# EAGLE design arduino_usb_08 (EAGLE 4.13)
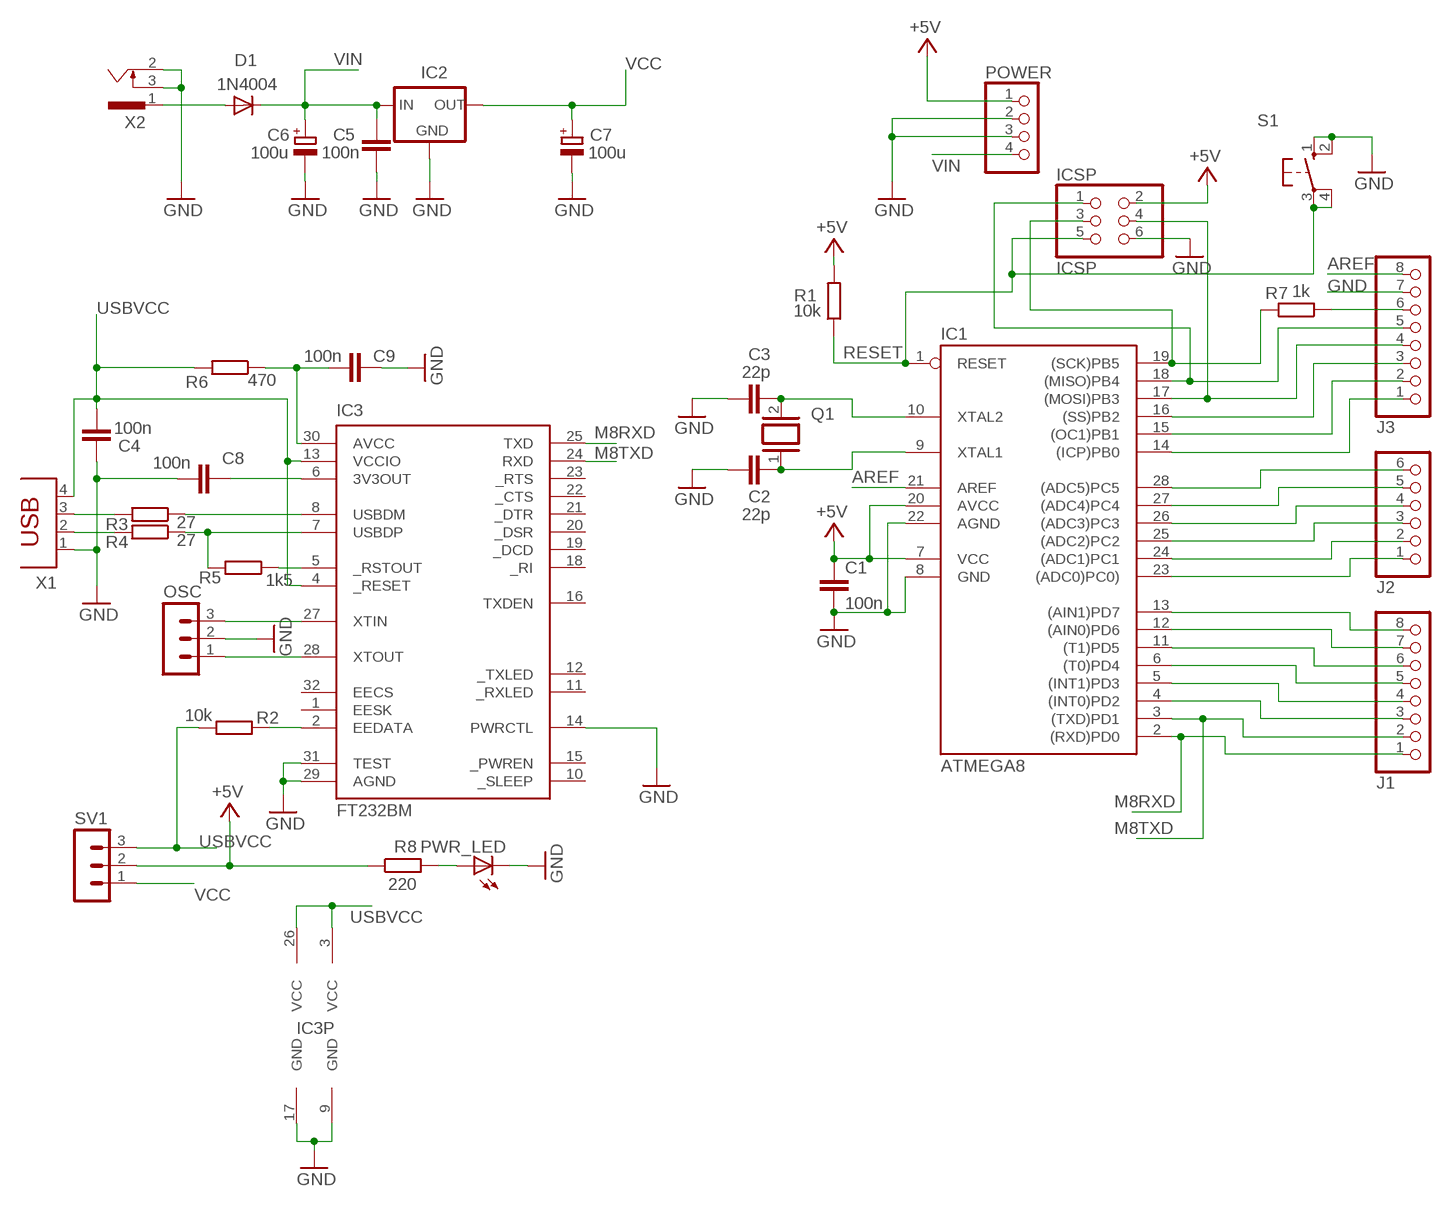
[diagram p0: schematic, sheet 1]

## Parts
C1  100n  C-EU050-025X075  [C050-025X075]
C2  22p  C-EU050-025X075  [C050-025X075]
C3  22p  C-EU050-025X075  [C050-025X075]
C4  100n  C-EU050-025X075  [C050-025X075]
C5  100n  C-EU050-025X075  [C050-025X075]
C6  100u  CPOL-EUE3.5-8  [E3,5-8]
C7  100u  CPOL-EUE3.5-8  [E3,5-8]
C8  100n  C-EU050-025X075  [C050-025X075]
C9  100n  C-EU050-025X075  [C050-025X075]
D1  1N4004  [DO41-10]
IC1  ATMEGA8  AT90S4433P  [DIL28-3]
IC2  78XXL  [78XXL]
IC3  FT232BM  [LQFP-32]
ICSP  ICSP  PINHD-2X3  [2X03]
J1  PINHD-1X8  [1X08]
J2  PINHD-1X6  [1X06]
J3  PINHD-1X8  [1X08]
OSC  MA03-1  [MA03-1]
POWER  PINHD-1X4  [1X04]
PWR_LED  LED3MM  [LED3MM]
Q1  XTAL/S  [QS]
R1  10k  R-EU_0207/10  [0207/10]
R2  10k  R-EU_0207/10  [0207/10]
R3  27  R-EU_0207/10  [0207/10]
R4  27  R-EU_0207/10  [0207/10]
R5  1k5  R-EU_0207/10  [0207/10]
R6  470  R-EU_0207/10  [0207/10]
R7  1k  R-EU_0207/10  [0207/10]
R8  220  R-EU_0207/10  [0207/10]
S1  10-XX  [B3F-10XX]
SV1  MA03-1  [MA03-1]
X1  PN61729  [PN61729]
X2  SCD-014A  [SCD-014-A]

## Nets
+5V [power]: C1.1 IC1.7(VCC) IC1.20(AVCC) ICSP.2 POWER.1 R1.2 R8.1 SV1.2
AREF: IC1.21(AREF) J3.8
GND [power]: C1.2 C2.1 C3.1 C4.2 C5.1 C6.- C7.- C8.1 C9.2 IC1.8(GND) IC1.22(AGND) IC2.GND IC3.9(GND) IC3.14(PWRCTL) IC3.17(GND) IC3.29(AGND) IC3.31(TEST) ICSP.6 J3.7 OSC.2 POWER.2 POWER.3 PWR_LED.K(C) S1.1(S) S1.2(S1) X1.1 X2.2 X2.3
M8RXD: IC1.2((RXD)PD0) IC3.25(TXD) J1.1
M8TXD: IC1.3((TXD)PD1) IC3.24(RXD) J1.2
N$1: IC1.18((MISO)PB4) ICSP.1 J3.5
N$2: J3.6 R7.1
N$3: PWR_LED.A R8.2
N$4: IC1.17((MOSI)PB3) ICSP.4 J3.4
N$5: IC1.14((ICP)PB0) J3.1
N$6: C2.2 IC1.9(XTAL1) Q1.1
N$7: C3.2 IC1.10(XTAL2) Q1.2
N$8 [power]: D1.A X2.1
N$9: R3.2 X1.3
N$10: IC1.4((INT0)PD2) J1.3
N$11: IC1.5((INT1)PD3) J1.4
N$12: IC1.6((T0)PD4) J1.5
N$13: IC1.11((T1)PD5) J1.6
N$14: IC1.12((AIN0)PD6) J1.7
N$15: IC1.13((AIN1)PD7) J1.8
N$16: IC1.23((ADC0)PC0)) J2.1
N$17: IC1.24((ADC1)PC1) J2.2
N$18: IC1.25((ADC2)PC2) J2.3
N$19: IC1.26((ADC3)PC3) J2.4
N$20: IC1.27((ADC4)PC4) J2.5
N$21: IC1.28((ADC5)PC5) J2.6
N$22: IC1.15((OC1)PB1) J3.2
N$23: IC1.16((SS)PB2) J3.3
N$24: R4.2 X1.2
N$25: IC3.8(USBDM) R3.1
N$26: IC3.7(USBDP) R4.1 R5.2
N$27: IC3.5(_RSTOUT) R5.1
N$28: C8.2 IC3.6(3V3OUT)
N$29: IC3.27(XTIN) OSC.3
N$30: C9.1 IC3.30(AVCC) R6.1
N$31: IC3.28(XTOUT) OSC.1
N$33: IC3.2(EEDATA) R2.2
RESET: IC1.1(RESET) ICSP.5 R1.1 S1.3(P) S1.4(P1)
SCK: IC1.19((SCK)PB5) ICSP.3 R7.2
USBVCC: C4.1 IC3.3(VCC) IC3.4(_RESET) IC3.13(VCCIO) IC3.26(VCC) R2.1 R6.2 SV1.3 X1.4
VCC: C7.+ IC2.OUT SV1.1
VIN [power]: C5.2 C6.+ D1.C IC2.IN POWER.4
Unconnected: IC3.1(EESK) IC3.10(_SLEEP) IC3.11(_RXLED) IC3.12(_TXLED) IC3.15(_PWREN) IC3.16(TXDEN) IC3.18(_RI) IC3.19(_DCD) IC3.20(_DSR) IC3.21(_DTR) IC3.22(_CTS) IC3.23(_RTS) IC3.32(EECS)

## Library data of the parts
C1-C5 C8 C9 = rcl:C-EU: CAPACITOR, European symbol
C6 C7 = rcl:CPOL-EU: POLARIZED CAPACITOR, European symbol
D1 = diode:1N4004: DIODE general purpose rectifier, 1 A
IC1 = atmel:AT90S4433: MICROCONTROLLER 4 Kbytes FLASH 128 bytes SRAM 256 bytes EEPROM UART 6-channel 10 bit ADC
IC2 = v-reg:78XXL: VOLTAGE REGULATOR
IC3 = ftdi:FT232BM: USB UART 2nd Generation USB UART (USB <-> Serial)
ICSP = pinhead:PINHD-2X3: PIN HEADER
J1 J3 = pinhead:PINHD-1X8: PIN HEADER
J2 = pinhead:PINHD-1X6: PIN HEADER
OSC SV1 = con-lstb:MA03-1: PIN HEADER
POWER = pinhead:PINHD-1X4: PIN HEADER
PWR_LED = led:LED: LED OSRAM: - CHIPLED LG R971, LG N971, LY N971, LG Q971, LY Q971, LO R971, LY R971 LH N974, LH R974 LS Q976, LO Q976, LY Q976 LO Q996 - Hyper CHIPLED LW Q18S LB Q993, LB Q99A, LB R99A - SideLED LS A670, LO A670, LY A670, LG A670, LP A670 LB A673, LV A673, LT A673, LW A673 LH A674 LY A675 LS A676, LA A676, LO A676, LY A676, LW A676 LS A679, LY A679, LG A679 - Hyper Micro SIDELED® LS Y876, LA Y876, LO Y876, LY Y876 LT Y87S - SmartLED LW L88C, LW L88S LB L89C, LB L89S, LG L890 LS L89K, LO L89K, LY L89K LS L896, LA L896, LO L896, LY L896 - TOPLED LS T670, LO T670, LY T670, LG T670, LP T670 LSG T670, LSP T670, LSY T670, LOP T670, LYG T670 LG T671, LOG T671, LSG T671 LB T673, LV T673, LT T673, LW T673 LH T674 LS T676, LA T676, LO T676, LY T676, LB T676, LH T676, LSB T676, LW T676 LB T67C, LV T67C, LT T67C, LS T67K, LO T67K, LY T67K, LW E67C LS E67B, LA E67B, LO E67B, LY E67B, LB E67C, LV E67C, LT E67C LW T67C LS T679, LY T679, LG T679 LS T770, LO T770, LY T770, LG T770, LP T770 LB T773, LV T773, LT T773, LW T773 LH T774 LS E675, LA E675, LY E675, LS T675 LS T776, LA T776, LO T776, LY T776, LB T776 LHGB T686 LT T68C, LB T68C - Hyper Mini TOPLED® LB M676 - Mini TOPLED Santana® LG M470 LS M47K, LO M47K, LY M47K Source: http://www.osram.convergy.de/
Q1 = special:XTAL/S: CRYSTAL
R1-R8 = rcl:R-EU_: RESISTOR, European symbol
S1 = switch-omron:10-XX: OMRON SWITCH
X1 = con-berg:PN61729: BERG USB connector
X2 = con-shiua-chyuan:SCD-014A: Power Jack 2.5mm

## Net classes
1 power: width 0.61 mm

## Board
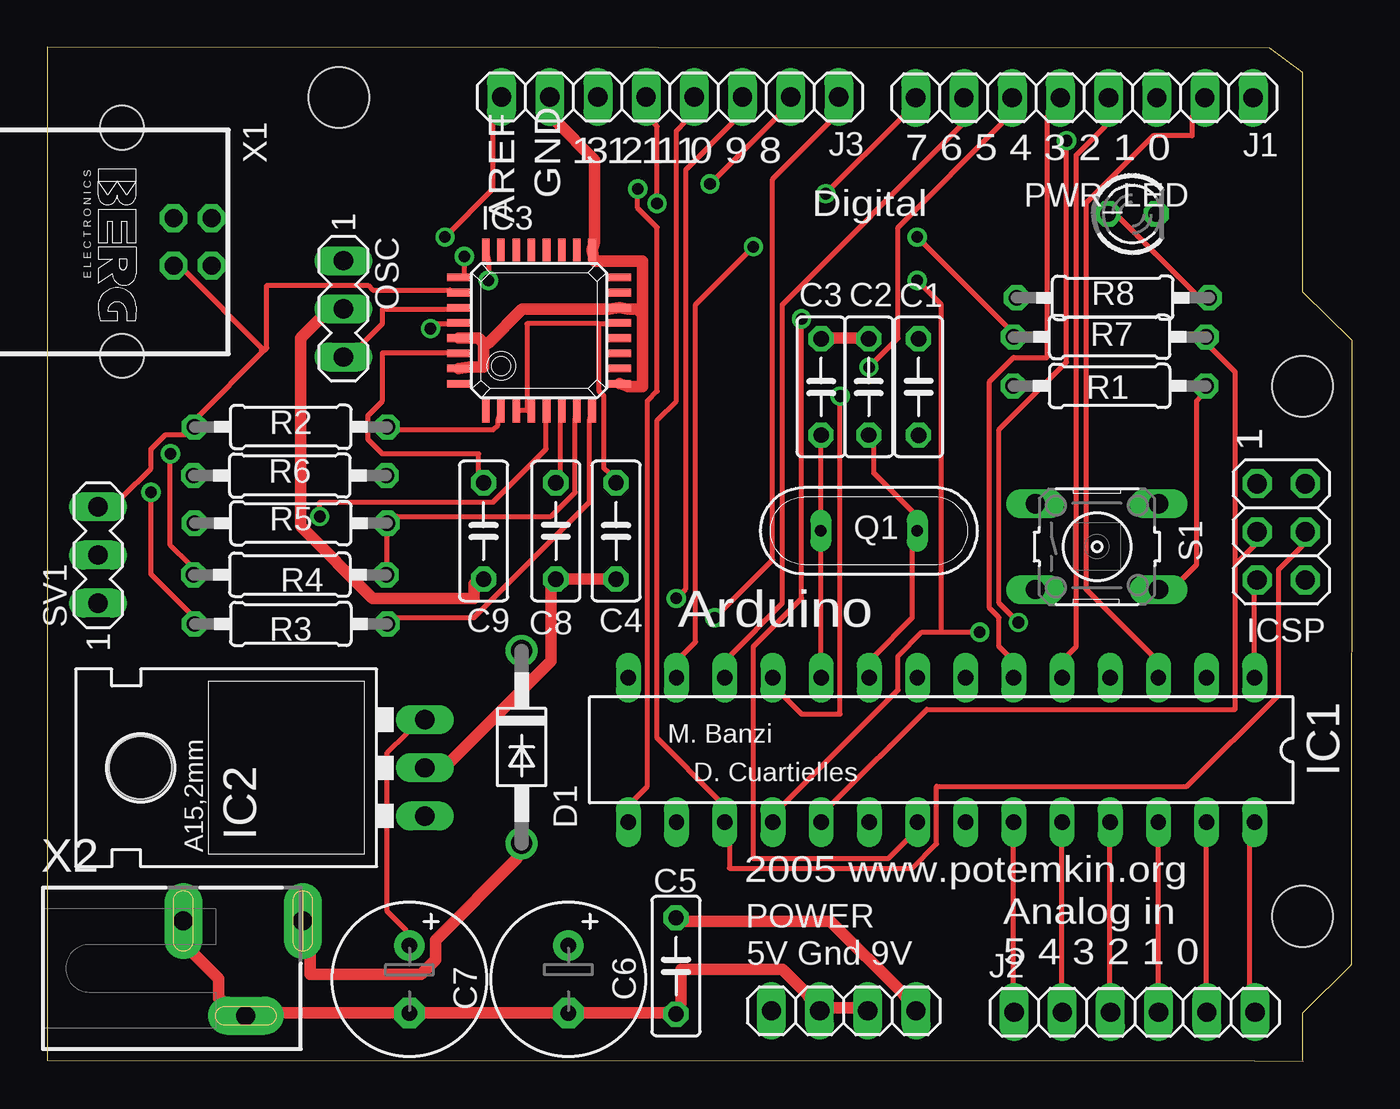
[diagram p1: board, top side]
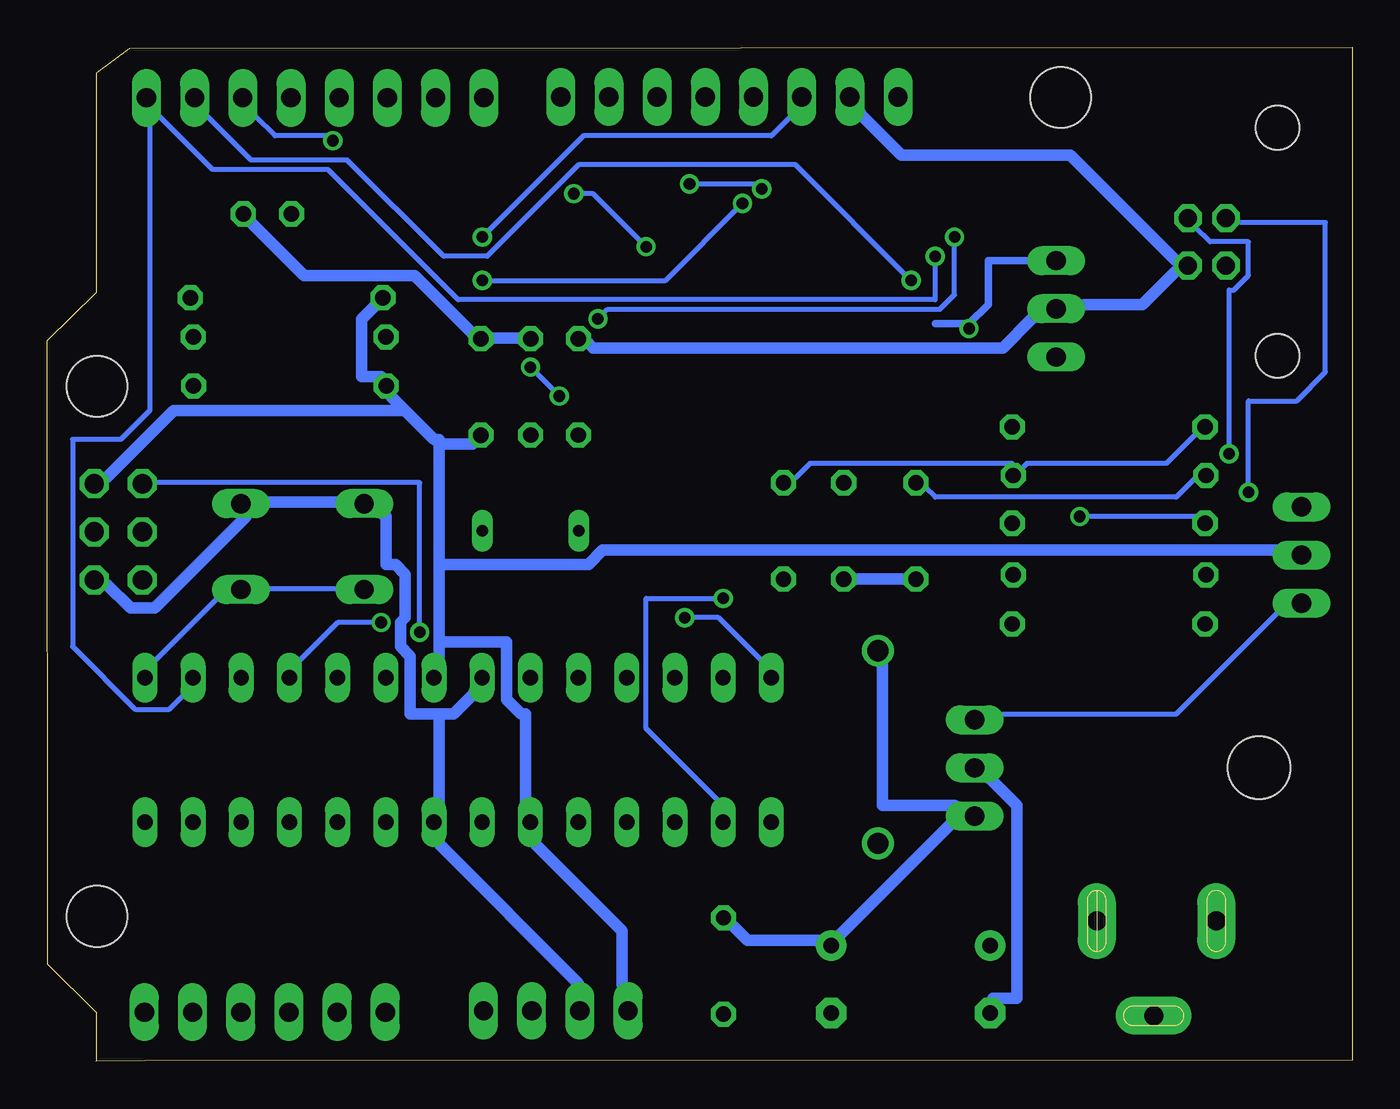
[diagram p2: board, bottom side, seen from below]

Size 68.77 x 53.44 mm. Coordinates in mm from the lower left corner, seen from the top.
Outline: 0,53.44 0,0.05 63.63,0.01 66.19,0 66.19,0.05 66.17,2.55 68.75,5.11 68.77,38 66.17,40.54 66.17,52.1 64.44,53.4 0,53.44
Copper layers (1*16): Top 0.035mm / dielectric 1.5mm / Bottom 0.035mm
Design rules "default": minimum track width 10mil, minimum drill 24mil, track to track 8mil, track to pad 8mil, pad to pad 8mil, via to via 8mil, smd to smd 8mil, copper to edge 40mil, drill to drill 8mil, minimum pad ring 10mil, minimum via ring 8mil, stop-mask expansion 4mil, vias tented up to drill 0mil, thermal gap 10mil
Holes 3.2 mm at 66.17,35.57 66.17,7.63 15.37,50.81

### Footprints (pad centres in the part's own frame; a part is rotated, then mirrored left to right if it is on the bottom)
C050-025X075 = drill 0.813 octagon: 1 -2.54,0; 2 2.54,0
E3,5-8 = drill 0.813 pad 1.6 round: + -1.778,0 | drill 0.813 pad 1.6 octagon: - 1.778,0
DO41-10 = drill 1.118 round: A 5.08,0; C -5.08,0
DIL28-3 = drill 0.813 long: 1 -16.51,-3.81; 2 -13.97,-3.81; 3 -11.43,-3.81; 4 -8.89,-3.81; 5 -6.35,-3.81; 6 -3.81,-3.81; 7 -1.27,-3.81; 8 1.27,-3.81; 9 3.81,-3.81; 10 6.35,-3.81; 11 8.89,-3.81; 12 11.43,-3.81; 13 13.97,-3.81; 14 16.51,-3.81; 15 16.51,3.81; 16 13.97,3.81; 17 11.43,3.81; 18 8.89,3.81; 19 6.35,3.81; 20 3.81,3.81; 21 1.27,3.81; 22 -1.27,3.81; 23 -3.81,3.81; 24 -6.35,3.81; 25 -8.89,3.81; 26 -11.43,3.81; 27 -13.97,3.81; 28 -16.51,3.81
78XXL = drill 1.016 long: GND 0,-3.81; IN -2.54,-3.81; OUT 2.54,-3.81 | hole 3.302: 0,11.176
LQFP-32 = smd 0.4 x 1.2: 1 -2.8,-4.25; 2 -2,-4.25; 3 -1.2,-4.25; 4 -0.4,-4.25; 5 0.4,-4.25; 6 1.2,-4.25; 7 2,-4.25; 8 2.8,-4.25; 17 2.8,4.25; 18 2,4.25; 19 1.2,4.25; 20 0.4,4.25; 21 -0.4,4.25; 22 -1.2,4.25; 23 -2,4.25; 24 -2.8,4.25 | smd 1.2 x 0.4: 9 4.25,-2.8; 10 4.25,-2; 11 4.25,-1.2; 12 4.25,-0.4; 13 4.25,0.4; 14 4.25,1.2; 15 4.25,2; 16 4.25,2.8; 25 -4.25,2.8; 26 -4.25,2; 27 -4.25,1.2; 28 -4.25,0.4; 29 -4.25,-0.4; 30 -4.25,-1.2; 31 -4.25,-2; 32 -4.25,-2.8
2X03 = drill 1.016 octagon: 1 -2.54,-1.27; 2 -2.54,1.27; 3 0,-1.27; 4 0,1.27; 5 2.54,-1.27; 6 2.54,1.27
1X08 = drill 1.016 long: 1 -8.89,0; 2 -6.35,0; 3 -3.81,0; 4 -1.27,0; 5 1.27,0; 6 3.81,0; 7 6.35,0; 8 8.89,0
1X06 = drill 1.016 long: 1 -6.35,0; 2 -3.81,0; 3 -1.27,0; 4 1.27,0; 5 3.81,0; 6 6.35,0
MA03-1 = drill 1.016 long: 1 -2.54,0; 2 0,0; 3 2.54,0
1X04 = drill 1.016 long: 1 -3.81,0; 2 -1.27,0; 3 1.27,0; 4 3.81,0
LED3MM = drill 0.813 octagon: A -1.27,0; K 1.27,0
QS = drill 0.61 long: 1 -2.54,0; 2 2.54,0
0207/10 = drill 0.813 octagon: 1 -5.08,0; 2 5.08,0
B3F-10XX = drill 1.016 long: 1 -3.251,2.261; 2 3.251,2.261; 3 -3.251,-2.261; 4 3.251,-2.261
PN61729 = drill 0.95 octagon: 1 1.25,4.71; 2 -1.25,4.71; 3 -1.25,2.71; 4 1.25,2.71 | hole 2.3: -6.02,0; 6.02,0
SCD-014-A = drill 1 pad 2 long: 1 -2.5,13.8; 2 -2.5,7.5; 3 2.5,10.8

### Placement (x,y rotation side)
C1  45.92,35.54 90 top
C2  43.3,35.55 270 top
C3  40.78,35.55 270 top
C4  29.97,27.95 270 top
C5  33.14,5.01 90 top
C6  27.46,4.32 270 top
C7  19.08,4.31 270 top
C8  26.8,27.95 90 top
C9  22.99,27.95 270 top
D1  25,16.56 270 top
IC1  47.13,16.4 180 top
IC2  16.09,15.46 90 top
IC3  25.91,38.52 0 top
ICSP  65.04,27.9 270 top
J1  54.67,50.79 180 top
J2  57.31,2.58 0 top
J3  32.83,50.83 180 top
OSC  15.6,39.66 270 top
POWER  41.97,2.65 0 top
PWR_LED  57.18,44.66 0 top
Q1  43.31,27.96 180 top
R1  55.99,35.6 180 top
R2  12.83,33.44 0 top
R3  12.83,23.05 180 top
R4  12.78,25.64 180 top
R5  12.83,28.36 0 top
R6  12.78,30.87 0 top
R7  56,38.18 0 top
R8  56.16,40.24 0 top
S1  55.33,27.12 0 top
SV1  2.67,26.68 90 top
X1  3.94,43.19 270 top
X2  -0.34,4.89 270 top

### Tracks (layer width: path | path; a pad name or v marks a point on that pad's centre or on a via)
+5V
  Bottom 0.61: POWER.1 38.48,4.07 38.48,6.87 43.06,11.44 IC1.20 43.56,13.73 43.56,18.3 43.82,18.3 44.58,19.06 44.58,22.11 48.14,22.11 | 48.14,26.17 48.14,32.52 | 48.14,26.17 48.14,22.11 | 48.14,22.11 48.14,21.35 IC1.7 | 48.14,32.52 46.36,32.52 C1.1 | 50.04,34.43 48.39,32.78 48.14,32.78 48.14,32.52 | 50.04,34.43 50.68,35.06 R1.2 51.18,36.08 52.2,36.08 52.2,39.13 R8.1 | SV1.2 3.94,26.93 39.5,26.93 40.26,26.17 48.14,26.17 | ICSP.2 65.66,30.74 62.11,34.3 50.17,34.3 50.04,34.43
AREF  (via drill 0.61)
  Top 0.254: v39.75,39.13 39.75,24.39 37.21,21.85 37.21,10.68 44.33,10.68 45.34,11.69 IC1.21 | v20.96,43.44 23.5,45.98 23.5,49.54 J3.8
  Bottom 0.254: v39.75,39.13 39.25,39.63 21.72,39.63 20.96,40.4 v20.96,43.44
GND
  Top 0.61: C3.1 41.28,38.11 42.8,38.11 C2.1 | 22.99,37.86 22.99,36.59 22.23,36.59 IC3.31 | 22.99,37.86 22.74,38.11 22.23,38.11 IC3.29 | 31.37,39.38 31.37,35.57 30.61,35.57 IC3.9 | 31.37,39.38 31.12,39.63 30.61,39.63 IC3.14 29.59,39.63 25.02,39.63 23.24,37.86 22.99,37.86 | 31.37,39.38 31.37,42.17 28.83,42.17 IC3.17 28.83,43.19 28.83,47.51 26.8,49.54 J3.7 | C4.2 C8.1 26.55,24.9 26.55,21.09 21.21,15.76 IC2.GND | X2.2 7.75,5.6 9.02,4.33 9.02,3.31 X2.3 12.32,2.55 18.42,2.55 C7.- 19.69,2.55 26.8,2.55 C6.- 28.07,2.55 32.64,2.55 C5.1 33.4,3.06 33.4,4.84 38.74,4.84 40.01,3.57 POWER.2 41.28,2.8 42.55,2.8 POWER.3 | OSC.2 14.35,39.13 13.34,38.11 13.34,28.2 17.15,24.39 22.48,24.39 22.48,25.16 C9.2
  Bottom 0.61: C2.1 43.82,38.11 45.34,38.11 C1.2 46.36,38.36 49.41,41.41 55.25,41.41 58.04,44.21 PWR_LED.K | J3.7 25.78,49.79 23.75,47.76 14.86,47.76 9.27,42.17 X1.1 9.27,41.67 11.05,39.89 14.1,39.89 OSC.2 16.89,39.13 18.42,37.6 40.01,37.6 40.26,37.86 C3.1 | C8.1 C9.2 | ICSP.6 65.66,25.16 64.39,23.89 63.12,23.89 58.3,28.71 S1.2 57.28,29.47 53.47,29.47 S1.1 50.93,28.71 50.93,26.17 50.42,26.17 49.91,25.66 49.91,23.38 50.17,23.12 50.17,21.85 49.66,21.35 49.66,18.3 48.14,18.3 | 48.14,18.3 48.14,13.73 IC1.22 48.14,11.44 40.77,4.07 POWER.2 | 48.14,18.3 47.37,18.3 46.36,19.31 IC1.8 | IC2.GND 18.93,14.74 17.66,13.47 17.66,3.31 18.93,3.31 C7.-
M8RXD  (via drill 0.61)
  Top 0.254: v21.97,42.43 21.97,41.41 IC3.25
  Bottom 0.254: v21.97,42.43 21.97,40.14 47.12,40.14 53.98,47 60.07,47 62.87,49.79 J1.1 63.38,49.29 63.38,34.3 64.9,32.78 67.44,32.78 67.44,21.85 64.14,18.55 62.36,18.55 61.6,19.31 IC1.2
M8TXD  (via drill 0.61)
  Top 0.254: v23.24,41.16 23.24,42.17 IC3.24 | IC1.3 58.3,21.35 54.74,24.9 54.74,45.22 58.3,48.78 60.33,48.78 60.33,49.79 J1.2
  Bottom 0.254: v23.24,41.16 29.34,47.25 40.77,47.25 45.6,42.43 47.88,42.43 52.96,47.51 58.04,47.51 60.33,49.79 J1.2
N$1  (via drill 0.61)
  Top 0.254: 47.12,22.62 v49.15,22.62 | 47.12,22.62 46.1,22.62 44.83,21.35 44.83,19.57 38.74,13.47 IC1.18 | v32.13,45.22 32.13,49.29 31.88,49.54 J3.5 | v45.85,41.16 47.12,39.89 47.12,22.62
  Bottom 0.254: v49.15,22.62 49.15,30.49 63.12,30.49 ICSP.1 | v32.13,45.22 36.2,41.16 v45.85,41.16
N$2  (via drill 0.61)
  Top 0.254: v45.85,43.44 50.68,38.62 R7.1
  Bottom 0.254: v45.85,43.44 40.52,48.78 30.61,48.78 29.59,49.79 J3.6
N$3
  Top 0.254: PWR_LED.A 56.52,44.46 60.84,40.14 R8.2
N$4
  Top 0.254: J3.4 33.66,49.54 33.15,49.03 33.15,34.81 32.13,33.79 32.13,17.03 35.44,13.73 IC1.17 35.94,11.44 35.94,10.17 45.6,10.17 46.87,11.44 46.87,14.49 60.07,14.49 64.9,19.31 64.9,25.92 66.17,27.19 ICSP.4
N$5  (via drill 0.61)
  Top 0.254: v35.18,23.38 38.23,26.43 38.23,46.49 41.28,49.54 J3.1
  Bottom 0.254: v35.18,23.38 33.4,23.38 31.12,21.09 IC1.14
N$6
  Top 0.254: C2.2 43.56,32.52 43.56,31 45.6,28.97 Q1.1 45.6,26.93 45.6,23.38 43.56,21.35 IC1.9
N$7
  Top 0.254: C3.2 40.77,32.52 40.77,28.97 Q1.2 40.77,26.93 40.77,21.35 IC1.10
N$8
  Top 0.61: D1.A 24.77,10.68 20.45,6.36 20.45,5.34 19.69,4.58 13.85,4.58 13.85,5.6 X2.1
N$9  (via drill 0.61)
  Top 0.254: v5.46,29.98 5.46,25.66 7.5,23.63 R3.2
  Bottom 0.254: v5.46,29.98 5.46,34.81 2.92,34.81 1.4,36.33 1.4,44.21 5.97,44.21 X1.3
N$10  (via drill 0.61)
  Top 0.254: v51.18,23.12 50.17,24.14 50.17,33.28 53.72,36.84 v53.72,48.52
  Bottom 0.254: v51.18,23.12 53.47,23.12 55.5,21.09 IC1.4 | v53.72,48.52 53.98,48.78 56.77,48.78 57.79,49.79 J1.3
N$11
  Top 0.254: IC1.5 53.72,21.35 54.23,21.85 54.23,47.76 55.76,49.29 J1.4
N$12
  Top 0.254: IC1.6 50.68,21.35 50.17,21.85 50.17,23.38 49.66,23.89 49.66,35.82 50.93,37.09 52.71,37.09 52.71,49.79 J1.5
N$13  (via drill 0.61)
  Top 0.254: v41.79,35.06 41.79,18.3 39.75,18.3 38.74,19.31 IC1.11 | v43.31,36.59 44.83,38.11 44.83,43.95 50.42,49.54 J1.6
  Bottom 0.254: v41.79,35.06 v43.31,36.59
N$14
  Top 0.254: IC1.12 35.94,21.35 38.74,24.14 38.74,39.89 48.14,49.29 J1.7
N$15  (via drill 0.61)
  Top 0.254: v37.21,42.94 34.17,39.89 34.17,22.11 33.4,21.35 IC1.13 | v41.02,45.73 45.09,49.79 J1.8
  Bottom 0.254: v37.21,42.94 40.01,45.73 v41.02,45.73
N$16
  Top 0.254: IC1.23 50.93,11.44 50.93,4.07 J2.1
N$17
  Top 0.254: IC1.24 53.47,11.44 53.47,4.07 J2.2
N$18
  Top 0.254: IC1.25 56.01,11.44 56.01,4.07 J2.3
N$19
  Top 0.254: IC1.26 58.55,11.44 58.55,4.07 J2.4
N$20
  Top 0.254: IC1.27 61.09,11.44 61.09,4.07 J2.5
N$21
  Top 0.254: IC1.28 63.38,11.44 63.38,4.07 J2.6
N$22  (via drill 0.61)
  Top 0.254: v31.12,45.98 31.12,44.97 32.13,43.95 32.13,35.32 31.63,34.81 31.63,14.49 30.86,13.73 IC1.15 | v34.93,46.24 38.48,49.79 J3.2
  Bottom 0.254: v31.12,45.98 31.37,46.24 v34.93,46.24
N$23  (via drill 0.61)
  Top 0.254: v33.15,24.39 33.66,24.9 33.66,47 36.2,49.54 J3.3
  Bottom 0.254: v33.15,24.39 37.21,24.39 37.21,17.54 33.4,13.73 IC1.16
N$24  (via drill 0.61)
  Top 0.254: v6.48,32.01 6.48,27.19 7.5,26.17 R4.2
  Bottom 0.254: v6.48,32.01 6.48,40.65 6.23,40.65 5.46,41.41 5.46,43.19 7.5,43.19 8.26,43.95 X1.2
N$25
  Top 0.254: IC3.8 28.58,33.79 28.58,29.47 22.48,23.38 18.42,23.38 R3.1
N$26
  Top 0.254: IC3.7 27.82,33.79 27.82,29.98 26.55,28.71 18.42,28.71 R5.2 17.91,26.17 R4.1
N$27  (via drill 0.61)
  Top 0.254: v14.35,28.71 14.35,29.47 23.5,29.47 26.29,32.27 26.29,33.79 IC3.5
  Bottom 0.254: v14.35,28.71 8.26,28.71 R5.1
N$28
  Top 0.254: IC3.6 27.05,33.79 27.05,31 C8.2
N$29
  Top 0.254: IC3.27 21.21,39.63 17.66,39.63 17.66,38.87 16.64,37.86 OSC.3
N$30
  Top 0.254: IC3.30 21.21,37.35 17.66,37.35 17.66,34.81 16.89,34.05 16.89,32.78 17.66,32.01 22.74,32.01 22.74,31 C9.1
  Bottom 0.254: R6.1 8.26,30.74 9.27,29.73 21.97,29.73 22.48,30.24 C9.1
N$31  (via drill 0.61)
  Top 0.254: v20.2,38.62 20.2,38.87 21.21,38.87 IC3.28
  Bottom 0.254: 20.2,38.87 v20.2,38.62
  Bottom 0.406: OSC.1 19.18,42.2 19.18,39.89 20.2,38.87 21.97,38.87
N$33
  Top 0.254: IC3.2 23.75,33.79 23.75,33.54 23.5,33.28 18.42,33.28 R2.2
RESET
  Top 0.254: IC1.1 63.63,21.35 63.63,24.65 ICSP.5 | R1.1 60.84,35.06 60.58,34.81 60.58,26.17 59.82,25.41 S1.4
  Bottom 0.254: S1.3 53.47,24.9 57.28,24.9 S1.4 59.82,24.39 63.12,21.09 IC1.1
SCK
  Top 0.254: 62.61,26.17 62.61,18.55 46.36,18.55 41.28,13.47 IC1.19 | 62.61,26.17 63.63,27.19 ICSP.3 | 62.61,26.17 62.61,36.33 61.34,37.6 R7.2
USBVCC
  Top 0.254: 25.28,34.3 25.53,34.3 IC3.4 | 25.28,34.3 24.77,34.3 IC3.3 | 29.09,38.87 25.28,38.87 25.28,34.3 | 29.09,38.87 29.59,38.87 IC3.13 | 29.09,38.87 29.09,35.32 29.34,35.06 29.34,31.25 29.59,31 C4.1 | 11.31,37.35 8,34.05 R2.1 7.24,33.03 6.23,33.03 5.46,32.27 5.46,31.25 3.94,29.73 SV1.3 | 11.31,37.35 11.56,37.6 11.56,40.9 16.89,40.9 17.15,40.65 21.21,40.65 IC3.26 | 11.31,37.35 11.31,37.6 7.24,41.67 X1.4
  Bottom 0.254: R2.1 8.26,33.03 9.78,31.51 17.15,31.51 17.4,31.25 R6.2 17.91,31.51 28.58,31.51 29.34,30.74 C4.1
VCC
  Top 0.254: C7.+ 18.93,6.87 17.91,7.88 17.91,16.27 18.93,17.28 IC2.OUT
  Bottom 0.254: SV1.1 3.94,23.63 9.27,18.3 18.42,18.3 IC2.OUT
VIN
  Top 0.61: POWER.4 45.09,3.57 41.28,7.38 33.66,7.38 C5.2
  Bottom 0.61: C5.2 32.64,7.12 31.88,6.36 28.07,6.36 C6.+ 27.05,6.61 21.21,12.46 IC2.IN 20.96,13.47 24.77,13.47 24.77,20.84 D1.C

### Text on the board
tNames: 1 1 1 1 | 3 2 1 0 9 8 | 7 6 5 4 3 2 1 0 | GND | Digital | AREF | 1 | Arduino | M. Banzi | D. Cuartielles | 2005 www.potemkin.org | Analog in | 5V Gnd 9V | 5 4 3 2 1 0